# Altium project FD-JUL-MB.PrjPcb (part 3 of 3)

## Sheet Noise.SchDoc
size B; DocumentNumber: 7; SheetNumber: 7; SheetTotal: 7; ENG_APP_DATE: --/--/--; DSN_APP_DATE: --/--/--; CHK_APP_DATE: --/--/--
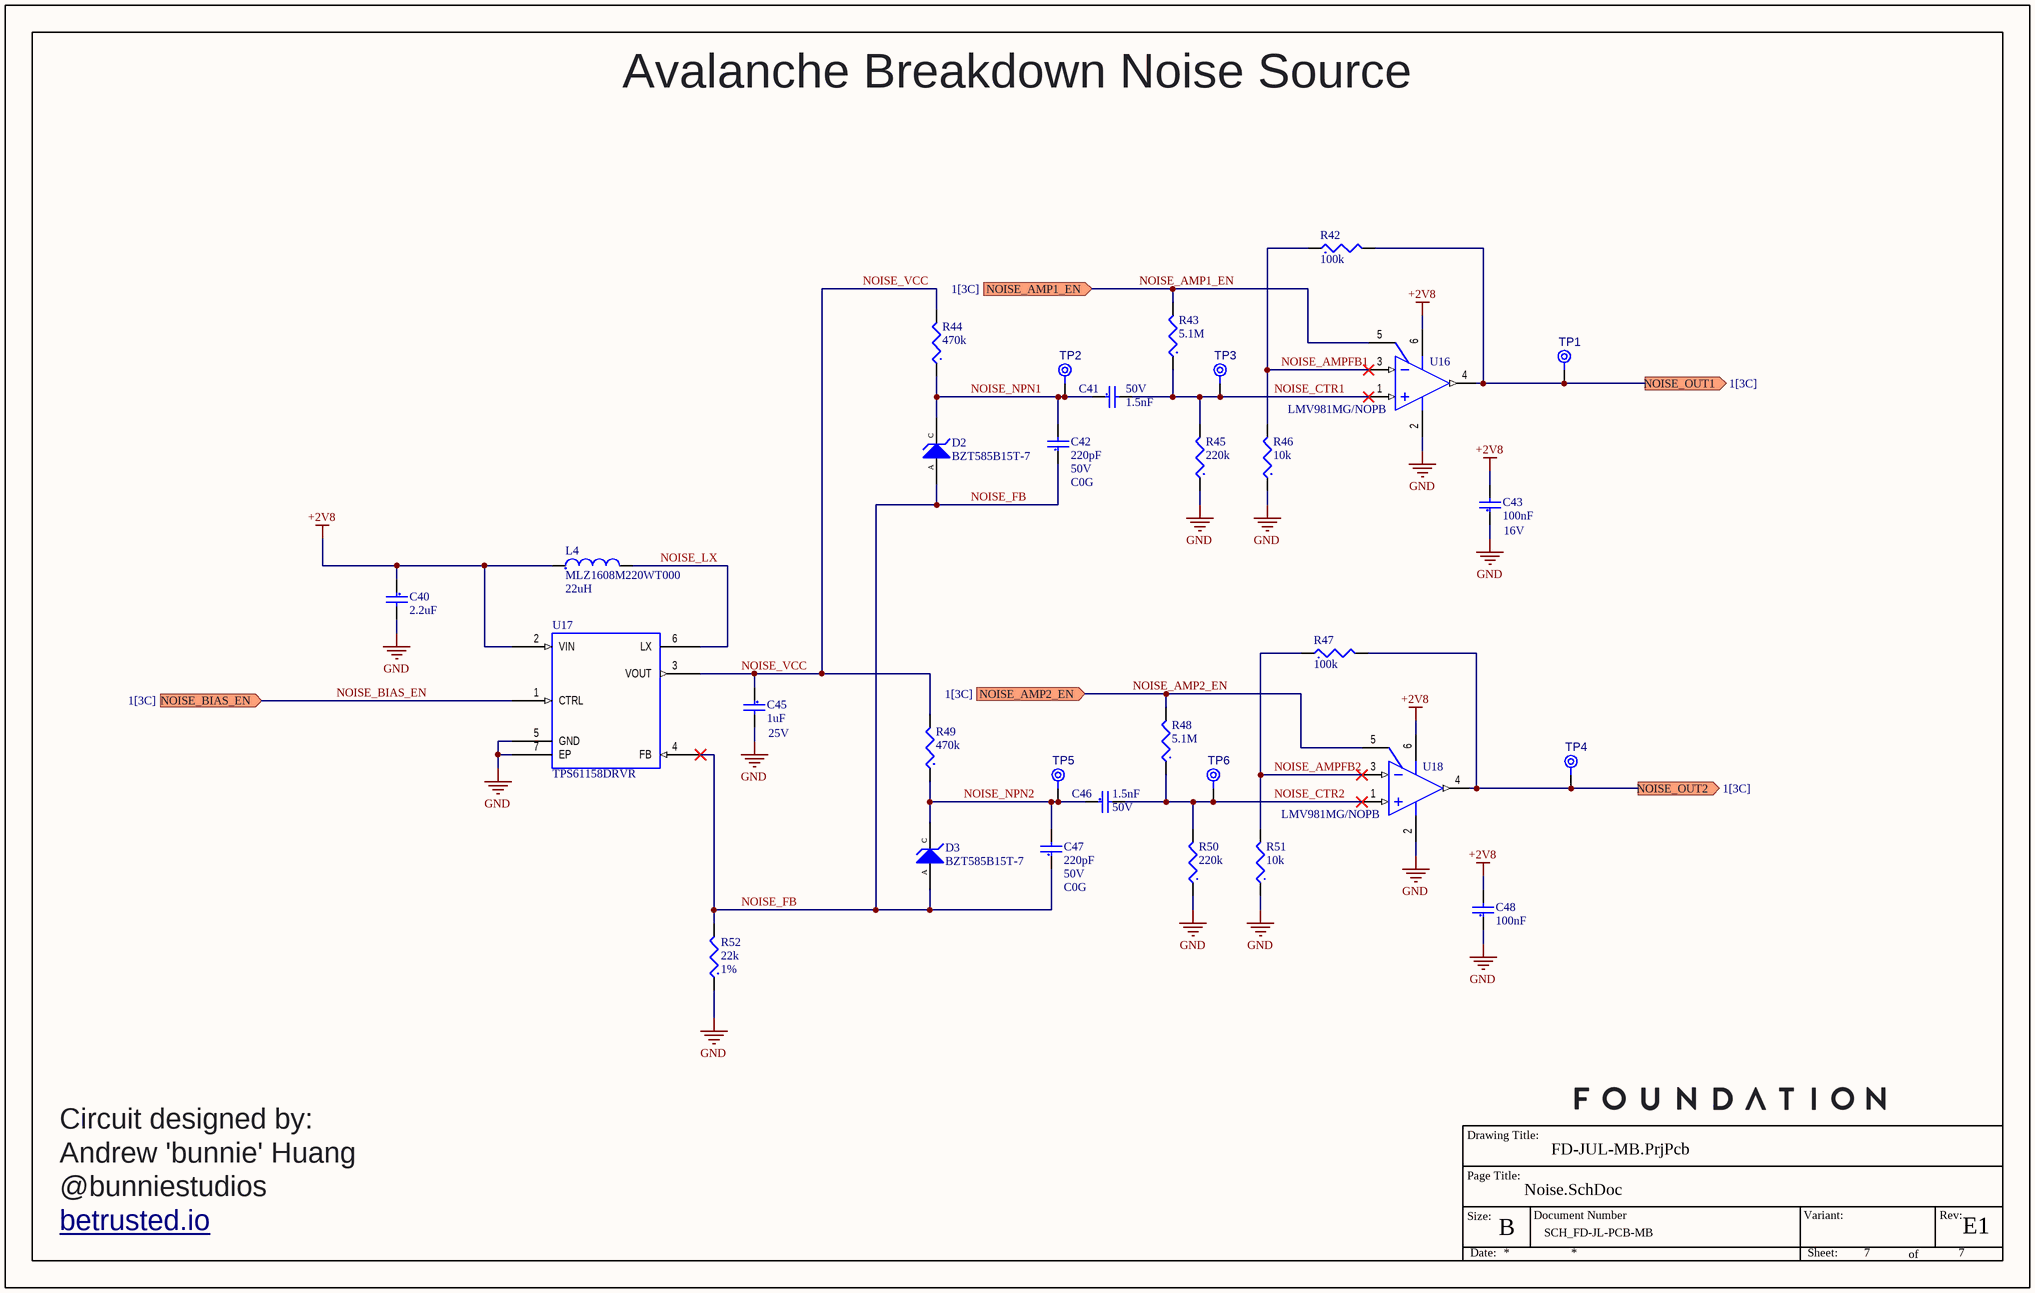
[diagram p6: Noise.SchDoc]

### Parts
C40  Capacitance: 2.2uF  [CAPC0402(1005)55_L]  (hidden comment: CAP CER 2.2uF 6.3V 10% X5R 0402)
C41  Capacitance: 1.5nF  Voltage Rating: 50V  [CAPC0402(1005)55_L]  (hidden comment: CAP CER 1500pF 50V 10% X7R 0402)
C42  Capacitance: 220pF  Voltage: 50V  Dielectric: C0G  [CAPC0402(1005)55_L]  (hidden comment: CAP CER 220pF 50V 5% C0G 0402)
C43  Capacitance: 100nF  Voltage: 16V  [CAPC0402(1005)55_L]  (hidden comment: CAP CER 0.1uF 16V 10% X7R 0402)
C45  Capacitance: 1uF  Rated DC Voltage (URdc): 25V  [CAPC0402(1005)55_L]  (hidden comment: CAP CER 1uF 25V 10% X5R 0402)
C46  Capacitance: 1.5nF  Voltage: 50V  [CAPC0402(1005)55_L]  (hidden comment: CAP CER 1500pF 50V 10% X7R 0402)
C47  Capacitance: 220pF  Voltage: 50V  Dielectric: C0G  [CAPC0402(1005)55_L]  (hidden comment: CAP CER 220pF 50V 5% C0G 0402)
C48  Capacitance: 100nF  [CAPC0402(1005)55_L]  (hidden comment: CAP CER 0.1uF 16V 10% X7R 0402)
D2  BZT585B15T-7  [DIOD - SOD-523-2_L]
D3  BZT585B15T-7  [DIOD - SOD-523-2_L]
L4  MLZ1608M220WT000  Inductance: 22uH  [INDC0603(1608)90_L]
R42  Resistance: 100k  [RESC0402(1005)_L]  (hidden comment: RES 100K 1/16W 1% 0402)
R43  Resistance: 5.1M  [RESC0402(1005)_L]  (hidden comment: RES 5.1M 1/16W 1% 0402)
R44  Resistance: 470k  [RESC0402(1005)_L]  (hidden comment: RES 470K 1/16W 1% 0402)
R45  Resistance: 220k  [RESC0402(1005)_L]  (hidden comment: RES 220K 1/16W 1% 0402)
R46  Resistance: 10k  [RESC0402(1005)_L]  (hidden comment: RES 10K 1/16W 1% 0402)
R47  Resistance: 100k  [RESC0402(1005)_L]  (hidden comment: RES 100K 1/16W 1% 0402)
R48  Resistance: 5.1M  [RESC0402(1005)_L]  (hidden comment: RES 5.1M 1/16W 1% 0402)
R49  Resistance: 470k  [RESC0402(1005)_L]  (hidden comment: RES 470K 1/16W 1% 0402)
R50  Resistance: 220k  [RESC0402(1005)_L]  (hidden comment: RES 220K 1/16W 1% 0402)
R51  Resistance: 10k  [RESC0402(1005)_L]  (hidden comment: RES 10K 1/16W 1% 0402)
R52  Resistance: 22k  Tolerance: 1%  [RESC0402(1005)_L]  (hidden comment: RES 22K 1/16W 1% 0402)
TP1  TPAD8R  [TP08R]  (value not drawn)  (no BOM)
TP2  TPAD8R  [TP08R]  (value not drawn)  (no BOM)
TP3  TPAD8R  [TP08R]  (value not drawn)  (no BOM)
TP4  TPAD8R  [TP08R]  (value not drawn)  (no BOM)
TP5  TPAD8R  [TP08R]  (value not drawn)  (no BOM)
TP6  TPAD8R  [TP08R]  (value not drawn)  (no BOM)
U16  LMV981MG/NOPB  [TI - SC70-6_L]
U17  TPS61158DRVR  [TI - WSON-6_L]
U18  LMV981MG/NOPB  [TI - SC70-6_L]

### Ports
NOISE_AMP1_EN (in, see 1[3C]), NOISE_AMP2_EN (in, see 1[3C]), NOISE_BIAS_EN (in, see 1[3C]), NOISE_OUT1 (out, see 1[3C]), NOISE_OUT2 (out, see 1[3C])

### Nets
+2V8: C40.1 C43.2 C48.2 L4.1 U16.6(VDD) U17.2(VIN) U18.6(VDD)
GND: C40.2 C43.1 C45.2 C48.1 R45.1 R46.1 R50.1 R51.1 R52.1 U16.2(GND) U17.5(GND) U17.7(EP) U18.2(GND)
NOISE_AMP1_EN: R43.2 U16.5(~{SHDN}) ; port NOISE_AMP1_EN
NOISE_AMP2_EN: R48.2 U18.5(~{SHDN}) ; port NOISE_AMP2_EN
NOISE_AMPFB1: R42.1 R46.2 U16.3(IN-)
NOISE_AMPFB2: R47.1 R51.2 U18.3(IN-)
NOISE_BIAS_EN: U17.1(CTRL) ; port NOISE_BIAS_EN
NOISE_CTR1: C41.2 R43.1 R45.2 TP3.1(TP) U16.1(IN+)
NOISE_CTR2: C46.2 R48.1 R50.2 TP6.1(TP) U18.1(IN+)
NOISE_FB: C42.1 C47.1 D2.A D3.A R52.2 U17.4(FB)
NOISE_LX: L4.2 U17.6(LX)
NOISE_NPN1: C41.1 C42.2 D2.C R44.1 TP2.1(TP)
NOISE_NPN2: C46.1 C47.2 D3.C R49.1 TP5.1(TP)
NOISE_OUT1: R42.2 TP1.1(TP) U16.4(OUT) ; port NOISE_OUT1
NOISE_OUT2: R47.2 TP4.1(TP) U18.4(OUT) ; port NOISE_OUT2
NOISE_VCC: C45.1 R44.2 R49.2 U17.3(VOUT)

### Notes on the sheet
- Avalanche Breakdown Noise Source
- Andrew 'bunnie' Huang
- @bunniestudios
- Circuit designed by:
- betrusted.io <http://betrusted.io>
- Drawing Title:
- Page Title:
- Size:
- B
- Document Number
- Variant:
- Rev:
- Date:
- Sheet:
- of

### Library data of the parts
C40 = CMP-CAP-00042-1: 2.2µF ±10% 6.3V Ceramic Capacitor X5R 0402 (1005 Metric); Lead Free: Lead Free; Tolerance: 10%; Width: 0.02inch; Number of Pins: 2; Contact Plating: Tin,Matte; Max Operating Temperature: 85°C; Termination: SMD/SMT; Voltage Rating: 6.3V; Thickness: 0.022inch; Case Code (Imperial): 0402; Case Code (Metric): 1005; Radiation Hardening: No; Package Quantity: 1; Mount: Surface Mount; Length: 1mm; Case/Package: 0402; REACH SVHC: No SVHC; Packaging: Tape and Reel; Min Operating Temperature: -55°C; Dielectric: X5R; Depth: 0.5mm; Voltage Rating (DC): 6.3V
C41 C46 = CMP-CAP-00034-1: 1500pF ±10% 50V Ceramic Capacitor X7R 0402 (1005 Metric); Case/Package: 0402; Thickness: 0.022inch; Max Operating Temperature: 125°C; Package Quantity: 1; Contact Plating: Tin; Dielectric: X7R; Min Operating Temperature: -55°C; Case Code (Metric): 1005; Length: 1mm; Packaging: Tape and Reel; Width: 0.02inch; Depth: 0.5mm; Material: Ceramic; Tolerance: 10%; Case Code (Imperial): 0402; Radiation Hardening: No; Height: 0.5mm; Mount: Surface Mount
  C41: Voltage: 50V
  C46: Voltage Rating: 50V
C42 C47 = CMP-CAP-00035-1: 220pF ±5% 50V Ceramic Capacitor C0G, NP0 0402 (1005 Metric); Temperature Coefficient: 30ppm/°C; Min Operating Temperature: -55°C; Voltage Rating (DC): 50V; Thickness: 0.022inch; Height: 0.5mm; Mount: Surface Mount; Ratings: AEC-Q200; Case Code (Imperial): 0402; Depth: 0.5mm; Length: 1mm; REACH SVHC: No SVHC; Termination: SMD/SMT; Case Code (Metric): 1005; Tolerance: 5%; Package Quantity: 1; Max Operating Temperature: 125°C; Case/Package: 0402; Radiation Hardening: No; Voltage Rating: 50V; Lead Free: Lead Free; Width: 0.02inch; Packaging: Tape and Reel
C43 C48 = CMP-CAP-00002-2: 0.1µF ±10% 16V Ceramic Capacitor X7R 0402 (1005 Metric); Insulation Resistance: 10GR; Case Code (Imperial): 0402; REACH SVHC: No SVHC; Lead Free: Lead Free; Radiation Hardening: No; Dielectric: X7R; Mount: Surface Mount; Packaging: Tape and Reel; Depth: 0.5mm; Case Code (Metric): 1005; Voltage Rating (DC): 16V; Termination: SMD/SMT; Voltage Rating: 16V; Number of Pins: 2; Tolerance: 10%; Min Operating Temperature: -55°C; Package Quantity: 1; Width: 0.5mm; Max Operating Temperature: 125°C; Length: 1mm; Thickness: 0.022inch; Case/Package: 0402; Material: Ceramic; Height: 0.5mm; Dielectric Material: Ceramic
  C48: Voltage: 16V
C45 = CMP-CAP-00053-1: ±10% 25V Ceramic Capacitor X5R 0402 (1005 Metric); Multilayer: Yes; Number of Terminals/Pins: 2; Width: 0.5mm; Termination: Wraparound; Min Operating Temperature: -55°C; Mount: Surface Mount; Length: 1mm; Capacitor Type: Ceramic; Max Operating Temperature: 85°C; Packaging: Tape and Reel; Height: 0.6mm; Dielectric Material: Ceramic; JESD-609 Code: e3; Negative Tolerance: 10%; Terminal Finish: Nickel; Package Style: SMTMeter; Size Code: 0402; Positive Tolerance: 10%; Package Shape: Rectangular; Temperature Characteristics Code: X5R
D2 D3 = CMP-DIO-0004-4: Zener Diode 15V 350mW ±2% Surface Mount SOD-523; Max Reverse Leakage Current: 50nA; ESD Protection: No; Forward Voltage: 900mV; Test Current: 5mA; Impedance: 15R; Element Configuration: Single; Package Quantity: 3000; Weight: 3.5E-05oz; Packaging: Tape and Reel; Peak Reverse Current: 50nA; Min Operating Temperature: -65°C; Tolerance: 2%; Max Power Dissipation: 350mW; Mount: Surface Mount; Zener Voltage: 15V; Contact Plating: Tin,Matte; Zener Current: 5mA; Case/Package: SOD-523-2; Number of Pins: 2; Voltage Tolerance: 2%; Max Operating Temperature: 150°C
L4 = CMP-IND-0005-1: 22µH Shielded Multilayer Inductor 150mA 2.4Ohm 0603 (1608 Metric); Test Frequency: 2MHz; Core Material: Ferrite; Saturation Current: 55mA; DC Resistance (DCR): 3.12R; Tolerance: 20%; Shielding: Shielded; Packaging: Tape and Reel; Width: 0.031inch; Min Operating Temperature: -55°C; Max Operating Temperature: 125°C; Current Rating: 150mA; Mount: Surface Mount; Height - Seated (Max): 0.037inch; Case/Package: 0603; Length: 0.063inch
R42 R47 = CMP-RES-00003-3: 100 kOhms ±1% 0.063W, 1/16W Chip Resistor 0402 (1005 Metric) Automotive AEC-Q200 Thick Film; Temperature Coefficient: 100ppm/°C; Voltage Rating (DC): 50V; Max Power Dissipation: 63mW; Number of Terminations: 2; Case/Package: 0402; Length: 1mm; Military Standard: Not; Mount: Surface Mount; Termination: SMD/SMT; Radiation Hardening: No; Package Quantity: 10000; Case Code (Metric): 1005; Case Code (Imperial): 0402; REACH SVHC: Unknown; Depth: 0.5mm; Features: Automotive AEC-Q200; Voltage Rating: 50V; Min Operating Temperature: -55°C; Lead Free: Lead Free; Power Rating: 63mW; Number of Pins: 2; Max Operating Temperature: 155°C; Contact Plating: Tin; Weight: 2.3E-05oz; Packaging: Tape and Reel; Tolerance: 1%; Height: 0.35mm; Composition: Thick Film; Width: 0.02inch
R43 R48 = CMP-RES-00042-1: 5.1 MOhms ±1% 0.1W, 1/10W Chip Resistor 0402 (1005 Metric); Voltage Rating: 50V; Power Rating: 63mW; Temperature Coefficient: 100ppm/°C; Weight: 2.3E-05oz; Termination: SMD/SMT; Case/Package: 0402; Max Operating Temperature: 155°C; Height: 0.016inch; Tolerance: 1%; Width: 0.02inch; Depth: 0.5mm; Case Code (Metric): 1005; Length: 1mm; Lead Free: Lead Free; REACH SVHC: Unknown; Packaging: Tape and Reel; Min Operating Temperature: -55°C; Military Standard: Not; Voltage Rating (DC): 50V; Number of Terminations: 2; Composition: Thick Film; Case Code (Imperial): 0402; Features: Automotive AEC-Q200; Max Power Dissipation: 63mW
R44 R49 = CMP-RES-00012-3: 470 kOhms ±1% 0.063W, 1/16W Chip Resistor 0402 (1005 Metric); Power Rating: 63mW; Temperature Coefficient: 100ppm/°C; Voltage Rating: 50V; Case Code (Imperial): 0402; Tolerance: 1%; Contact Plating: Tin; Package Quantity: 10; Number of Terminations: 2; Mount: Surface Mount; Case/Package: 0402; Military Standard: Not; REACH SVHC: Unknown; Packaging: Tape and Reel; Composition: Thick Film; Max Operating Temperature: 155°C; Radiation Hardening: No; Length: 1mm; Max Power Dissipation: 63mW; Min Operating Temperature: -55°C; Features: Automotive AEC-Q200; Width: 0.02inch; Height: 0.35mm; Weight: 2.3E-05oz; Termination: SMD/SMT; Case Code (Metric): 1005; Depth: 0.5mm; Number of Pins: 2
R45 R50 = CMP-RES-00039-1: 220 kOhms ±1% 0.063W, 1/16W Chip Resistor 0402 (1005 Metric); Voltage Rating (DC): 50V; Max Power Dissipation: 63mW; Temperature Coefficient: 100ppm/°C; Contact Plating: Tin; Depth: 0.5mm; Height: 0.35mm; Tolerance: 1%; Case Code (Imperial): 0402; Case Code (Metric): 1005; REACH SVHC: Unknown; Weight: 2.3E-05oz; Mount: Surface Mount; Packaging: Tape and Reel; Radiation Hardening: No; Max Operating Temperature: 155°C; Features: Automotive AEC-Q200; Width: 0.5mm; Length: 1mm; Power Rating: 63mW; Composition: Thick Film; Package Quantity: 10; Voltage Rating: 50V; Termination: SMD/SMT; Number of Terminations: 2; Case/Package: 0402; Min Operating Temperature: -55°C; Military Standard: Not; Lead Free: Lead Free
R46 R51 = CMP-RES-00006-3: 10 kOhms ±1% 0.063W, 1/16W Chip Resistor 0402 (1005 Metric); Temperature Coefficient: 100ppm/°C; Power Rating: 63mW; Voltage Rating (DC): 50V; Tolerance: 1%; Height: 0.35mm; Lead Free: Lead Free; Number of Pins: 2; Termination: SMD/SMT; Features: Automotive AEC-Q200; Max Power Dissipation: 63mW; Min Operating Temperature: -55°C; Depth: 0.5mm; Case Code (Imperial): 0402; Military Standard: Not; Max Operating Temperature: 155°C; Weight: 2.3E-05oz; Case/Package: 0402; Width: 0.02inch; Length: 1mm; Number of Terminations: 2; Radiation Hardening: No; Case Code (Metric): 1005; Voltage Rating: 50V; Composition: Thick Film; REACH SVHC: Unknown; Mount: Surface Mount; Package Quantity: 10; Contact Plating: Tin; Packaging: Tape and Reel
R52 = CMP-RES-00040-1: 22 kOhms ±1% 0.063W, 1/16W Chip Resistor 0402 (1005 Metric); Max Power Dissipation: 63mW; Voltage Rating (DC): 50V; Temperature Coefficient: 100ppm/°C; Depth: 0.5mm; Composition: Thick Film; Number of Terminations: 2; Features: Automotive AEC-Q200; Power Rating: 63mW; Radiation Hardening: No; Min Operating Temperature: -55°C; Termination: SMD/SMT; Voltage Rating: 50V; Lead Free: Lead Free; Width: 0.5mm; Contact Plating: Tin; Weight: 2.3E-05oz; Length: 1mm; Packaging: Tape and Reel; REACH SVHC: Unknown; Package Quantity: 10; Mount: Surface Mount; Working Voltage: 50V; Case/Package: 0402; Case Code (Metric): 1005; Max Operating Temperature: 155°C; Military Standard: Not; Height: 0.35mm; Case Code (Imperial): 0402
TP1-TP6 = CMP-MECH-00011-2: 0.8mm round; Pins: 1
U16 U18 = CMP-IC-AMP-0000-7: General Purpose Amplifier 1 Circuit Rail-to-Rail SC-70-6; Slew Rate: 0.42V/µs; Output Current: 8mA; Output Current per Channel: 100mA; Number of Amplifiers: 1; Common Mode Rejection Ratio: 50dB; Operating Supply Current: 116uA; Unity Gain Bandwidth Product: 1.5MHz; Nominal Supply Current: 103uA; Bandwidth: 1.4MHz; Power Supply Rejection Ratio (PSRR): 75dB; Min Supply Voltage: 1.8V; Input Offset Voltage (Vos): 4mV; Max Supply Voltage: 5V; Operating Supply Voltage: 3V; Input Bias Current: 35nA; Voltage Gain: 113dB; ComponentLink1Description: Datasheet; Length: 2mm; Radiation Hardening: No; Width: 1.25mm; Min Operating Temperature: -40°C; Number of Circuits: 1; REACH SVHC: No SVHC; Contact Plating: Tin; Case/Package: SC; Number of Channels: 1; Package Quantity: 1000; Gain Bandwidth Product: 1.5MHz; Mount: Surface Mount; Height: 0.9mm; Weight: 0.01lb; Lead Free: Lead Free; ComponentLink1URL: http://www.ti.com/lit/ds/symlink/lmv981-n.pdf?ts=1588113028077; Number of Elements: 1; Packaging: Tape and Reel; Number of Pins: 6; Max Operating Temperature: 125°C
U17 = CMP-PMIC-00014-5: LED Driver IC 1 Output DC DC Regulator Step-Up (Boost) PWM Dimming 30mA 6-WSON (2x2); Frequency: 750kHz; Output Voltage: 29V; Min Supply Voltage: 2.7V; Number of Segments: 8; Number of Channels: 1; Max Input Voltage: 5.5V; Quiescent Current: 7mA; Nominal Input Voltage (DC): 3.6V; Max Supply Current: 1.65mA; Radiation Hardening: No; Mount: Surface Mount; Max Output Voltage: 29V; Topology: Boost; Switching Frequency: 750kHz; Number of Pins: 6; Packaging: Tape and Reel; Output Current per Channel: 30mA; Min Operating Temperature: -40°C; Min Output Voltage: 2.7V; Max Operating Temperature: 85°C; Number of Outputs: 1; Dimming: PWM; Lead Free: Lead Free; Max Supply Voltage: 5.5V; Max Output Current: 30mA; Output Current: 30mA; Package Quantity: 3000; ComponentLink1URL: https://www.ti.com/lit/ds/symlink/tps61158.pdf?HQS=TI-null-null-digikeymode-df-pf-null-wwe&ts=1592340693466; ComponentLink1Description: Datasheet

## Nets that join several sheets
+2V5_VREF: STM32H753 (C5.2 U2.20), Power (5 pins)
+2V8: STM32H753 (26 pins), LCD-Memory (13 pins), Interface (19 pins), Power (19 pins), Camera (R55.2 R56.2 R63.1), Noise (7 pins)
+5V0: LCD-Memory (6 pins), Power (C35.1 R35.2 TP11.1 U13.4), Camera (C3.1 U21.A1 U21.C3)
GND: STM32H753 (26 pins), LCD-Memory (22 pins), Interface (34 pins), Power (41 pins), Camera (5 pins), Noise (13 pins)
ALS_OUT: STM32H753 (U2.17), LCD-Memory (R61.2 U5.4)
BKLED_A: LCD-Memory (C25.1 J3.3 J3.4), Power (C37.1 TP13.1 U15.4)
BKLED_C: LCD-Memory (C25.2 J3.1 J3.2), Power (R41.2 TP14.1 U15.2)
BKLED_EN: STM32H753 (U2.95), Power (R40.1 TP15.1 U15.1)
BUF1_OE_b: STM32H753 (U2.39), Camera (P1.2 R55.1)
BUF2_OE_b: STM32H753 (U2.40), Camera (P1.4 R56.1)
DCMI_D0: STM32H753 (U2.63), Camera (P1.5)
DCMI_D1: STM32H753 (U2.64), Camera (P1.9)
DCMI_D2: STM32H753 (U2.97), Camera (P1.11)
DCMI_D3: STM32H753 (U2.98), Camera (P1.15)
DCMI_D4: STM32H753 (U2.3), Camera (P1.17)
DCMI_D5: STM32H753 (U2.84), Camera (P1.13)
DCMI_D6: STM32H753 (U2.4), Camera (P1.19)
DCMI_D7: STM32H753 (U2.5), Camera (P1.14)
DCMI_HREF: STM32H753 (U2.28), Camera (P1.16)
DCMI_PCLK: STM32H753 (U2.30), Camera (P1.10)
DCMI_PWDN: STM32H753 (U2.37), Camera (P1.8)
DCMI_VSYNC: STM32H753 (U2.93), Camera (P1.12)
DCMI_XVCLK: STM32H753 (U2.35), Camera (P1.6)
EXTCOMMIN: STM32H753 (U2.67), LCD-Memory (J2.7)
I2C1_SCL: STM32H753 (U2.92), Camera (P1.20)
I2C1_SDA: STM32H753 (U2.96), Camera (P1.18)
I2C2_SCL: STM32H753 (U2.46), Interface (R11.1 U4.23)
I2C2_SDA: STM32H753 (U2.47), Interface (R10.1 U4.22)
JTAG_RST: STM32H753 (U2.90), Interface (J4.9)
JTAG_TCK: STM32H753 (U2.76), Interface (J4.4)
JTAG_TDI: STM32H753 (R73.2), Interface (J4.8 R14.2)
JTAG_TDO: STM32H753 (U2.89), Interface (J4.6)
JTAG_TMS: STM32H753 (U2.72), Interface (J4.2 R15.2)
KBD_INT#: STM32H753 (U2.51), Interface (R12.1 U4.24)
KBD_RST#: STM32H753 (U1.4), Interface (R13.1 U4.20)
LCD_DISP: STM32H753 (U2.45), LCD-Memory (C21.1 J2.6)
LCD_SCLK: STM32H753 (R5.1), LCD-Memory (J2.10)
LCD_SCS: STM32H753 (R9.2), LCD-Memory (R57.2 U19.2)
LCD_SI: STM32H753 (U2.31), LCD-Memory (J2.9)
NOISE_AMP1_EN: STM32H753 (U2.56), Noise (R43.2 U16.5)
NOISE_AMP2_EN: STM32H753 (U2.55), Noise (R48.2 U18.5)
NOISE_BIAS_EN: STM32H753 (U2.57), Noise (U17.1)
NOISE_OUT1: STM32H753 (U2.16), Noise (R42.2 TP1.1 U16.4)
NOISE_OUT2: STM32H753 (U2.15), Noise (R47.2 TP4.1 U18.4)
PWR_EN: STM32H753 (U2.38), Camera (P1.7)
PWR_SHDN: STM32H753 (U2.36), Power (R33.2 U12.7)
PWR_SW: Interface (D1.C SW6.3), Power (R31.1 TP8.1 U12.3)
PWRMON_I: STM32H753 (U2.33), Power (Q2.3 R39.2 TP12.1)
PWRMON_V: STM32H753 (U2.32), Power (R6.1 R34.2 TP10.1)
SD_CD: STM32H753 (U2.2), Interface (5 pins)
SD_CK: STM32H753 (R74.2), Interface (J1.5 R20.2 U7.4 U7.7)
SD_CMD: STM32H753 (U2.83), Interface (J1.3 R21.2 U6.5 U6.6)
SD_D0: STM32H753 (U2.65), Interface (J1.7 R16.2 U7.2 U7.9)
SD_D1: STM32H753 (U2.66), Interface (J1.8 R17.2 U7.1 U7.10)
SD_D2: STM32H753 (U2.78), Interface (J1.1 R18.2 U6.2 U6.9)
SD_D3: STM32H753 (U2.79), Interface (J1.2 R19.2 U6.4 U6.7)
SE_SWD: STM32H753 (U2.22), LCD-Memory (R26.1 TP9.1 U10.5)
SPI4_MISO: STM32H753 (U2.43), LCD-Memory (U9.2)
SPI4_MOSI: STM32H753 (U2.44), LCD-Memory (U9.5)
SPI4_NSS: STM32H753 (U2.41), LCD-Memory (U9.1)
SPI4_SCK: STM32H753 (U2.42), LCD-Memory (U9.6)
SYS_RST#: STM32H753 (5 pins), Interface (J4.10)

## Assembly variants
Production: not fitted C2 C19 C38 C49 C54 LED3 LED4 R8 R23 R53 R58 R62 R63 R65 R66 R67 R68 R73 SW1 SW2 SW3 SW4 SW5 SW6 SW7 SW8 SW9 SW10 SW11 SW12 SW13 SW14 SW15 SW16 SW17 SW18 SW19 SW20 U3 U19